# EAGLE design untitled (EAGLE 9.6.2)
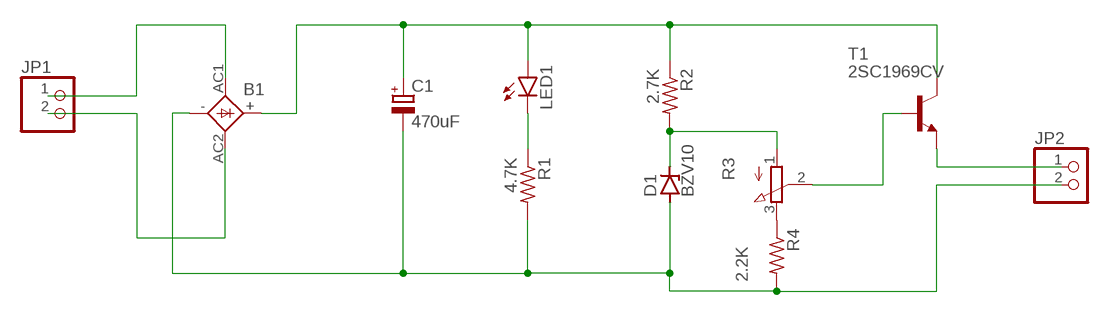
[diagram p0: schematic, sheet 1]

## Parts
B1  1KAB  [1KAB]
C1  470uF  CPOL-EUE3.5-10  [E3,5-10]
D1  BZV10  [DO34Z7]
JP1  PINHD-1X2  [1X02]
JP2  PINHD-1X2  [1X02]
LED1  LED5MM  [LED5MM]
R1  4.7K  R-US_0309/12  [0309/12]
R2  2.7K  R-US_0309/12  [0309/12]
R3  3RP/1610N  [3RP/1610N]
R4  2.2K  R-US_0309/12  [0309/12]
T1  2SC1969CV  [T-30_V]

## Nets
N$1: R3.3(E) R4.1
N$2: B1.AC1 JP1.1
N$3: B1.AC2 JP1.2
N$4: B1.+ C1.+ LED1.A R2.1 T1.2(C)
N$5: B1.- C1.- D1.A JP2.2 R1.2 R4.2
N$6: LED1.K(C) R1.1
N$7: D1.C R2.2 R3.1(A)
N$8: R3.2(S) T1.1(B)
N$9: JP2.1 T1.3(E)

## Library data of the parts
B1 = rectifier:1KAB: RECTIFIER grid 5,08 x 5,08 mm
C1 = rcl:CPOL-EU: POLARIZED CAPACITOR, European symbol; SPICEPREFIX: C
D1 = diode:BZV10: Z DIODE
JP1 JP2 = pinhead:PINHD-1X2: PIN HEADER
LED1 = led:LED: LED OSRAM: - CHIPLED LG R971, LG N971, LY N971, LG Q971, LY Q971, LO R971, LY R971 LH N974, LH R974 LS Q976, LO Q976, LY Q976 LO Q996 - Hyper CHIPLED LW Q18S LB Q993, LB Q99A, LB R99A - SideLED LS A670, LO A670, LY A670, LG A670, LP A670 LB A673, LV A673, LT A673, LW A673 LH A674 LY A675 LS A676, LA A676, LO A676, LY A676, LW A676 LS A679, LY A679, LG A679 - Hyper Micro SIDELED® LS Y876, LA Y876, LO Y876, LY Y876 LT Y87S - SmartLED LW L88C, LW L88S LB L89C, LB L89S, LG L890 LS L89K, LO L89K, LY L89K LS L896, LA L896, LO L896, LY L896 - TOPLED LS T670, LO T670, LY T670, LG T670, LP T670 LSG T670, LSP T670, LSY T670, LOP T670, LYG T670 LG T671, LOG T671, LSG T671 LB T673, LV T673, LT T673, LW T673 LH T674 LS T676, LA T676, LO T676, LY T676, LB T676, LH T676, LSB T676, LW T676 LB T67C, LV T67C, LT T67C, LS T67K, LO T67K, LY T67K, LW E67C LS E67B, LA E67B, LO E67B, LY E67B, LB E67C, LV E67C, LT E67C LW T67C LS T679, LY T679, LG T679 LS T770, LO T770, LY T770, LG T770, LP T770 LB T773, LV T773, LT T773, LW T773 LH T774 LS E675, LA E675, LY E675, LS T675 LS T776, LA T776, LO T776, LY T776, LB T776 LHGB T686 LT T68C, LB T68C - Hyper Mini TOPLED® LB M676 - Mini TOPLED Santana® LG M470 LS M47K, LO M47K, LY M47K Source: http://www.osram.convergy.de LUXEON: - LUMILED® LXK2-PW12-R00, LXK2-PW12-S00, LXK2-PW14-U00, LXK2-PW14-V00 LXK2-PM12-R00, LXK2-PM12-S00, LXK2-PM14-U00 LXK2-PE12-Q00, LXK2-PE12-R00, LXK2-PE12-S00, LXK2-PE14-T00, LXK2-PE14-U00 LXK2-PB12-K00, LXK2-PB12-L00, LXK2-PB12-M00, LXK2-PB14-N00, LXK2-PB14-P00, LXK2-PB14-Q00 LXK2-PR12-L00, LXK2-PR12-M00, LXK2-PR14-Q00, LXK2-PR14-R00 LXK2-PD12-Q00, LXK2-PD12-R00, LXK2-PD12-S00 LXK2-PH12-R00, LXK2-PH12-S00 LXK2-PL12-P00, LXK2-PL12-Q00, LXK2-PL12-R00 Source: www.luxeon.com KINGBRIGHT: KA-3528ASYC Source: www.kingbright.com
R1 R2 R4 = rcl:R-US_: RESISTOR, American symbol; SPICEPREFIX: R
R3 = pot:3RP/1610N: 16mm Potentiometer one level Source: http://www.alphapotentiometers.net/html/16mm_pot_2.html
T1 = transistor:2SC1969: NPN Epitaxial Planar Transistor RF Power Amplifier Source: 2sc1969.pdf

## Board
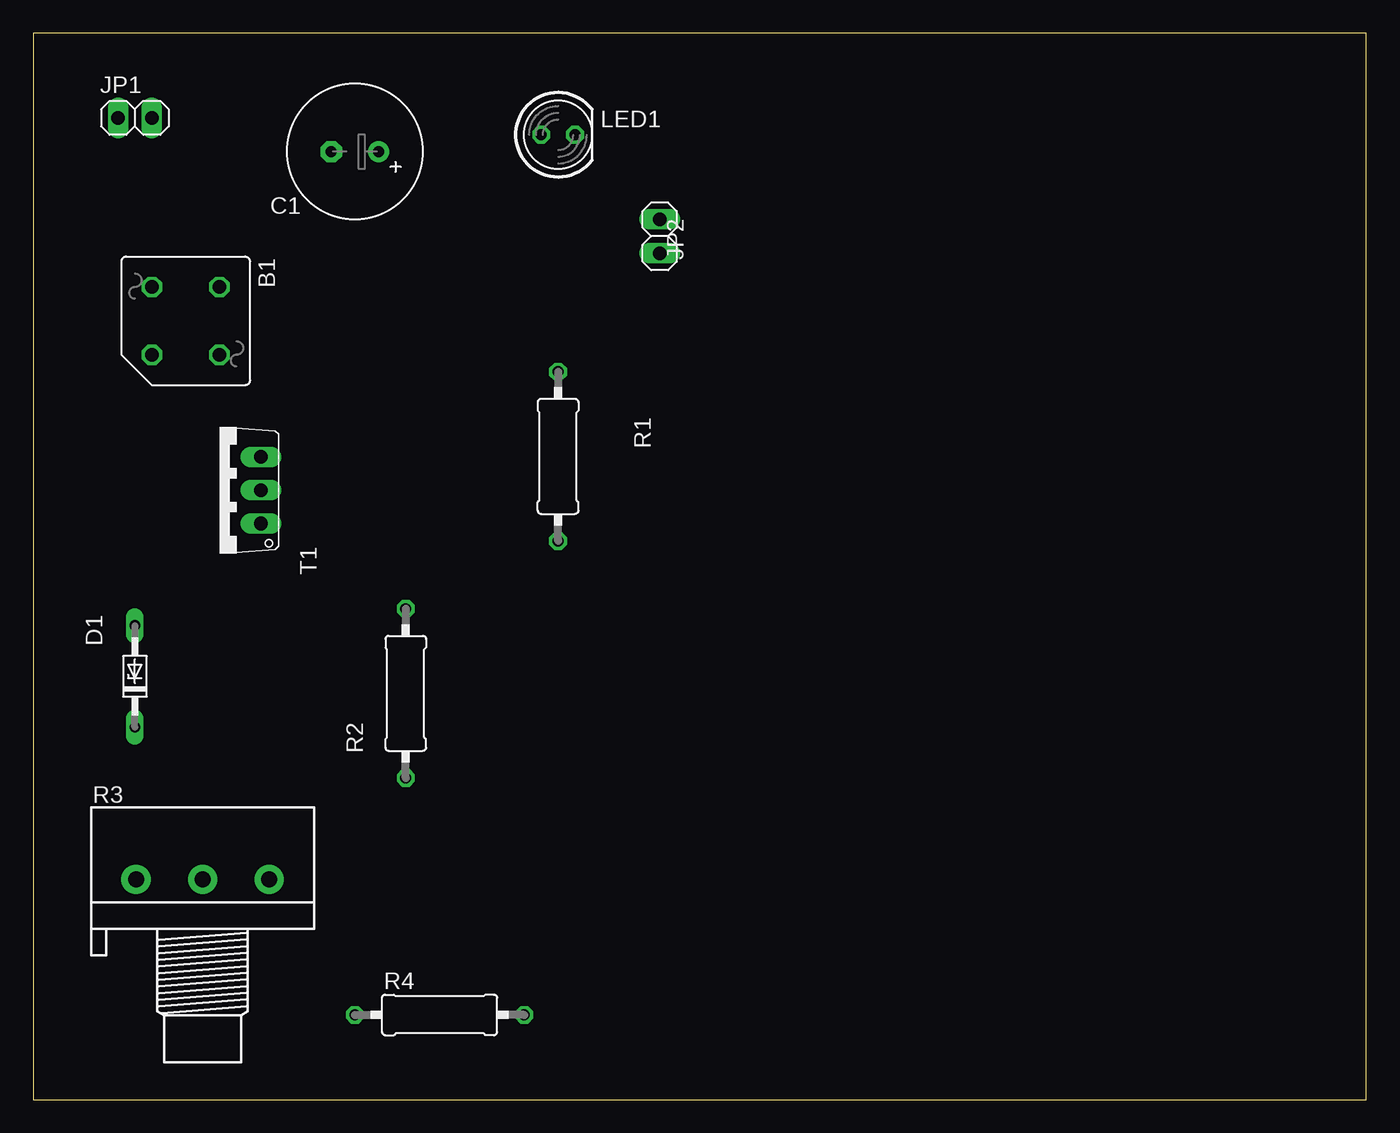
[diagram p1: board, top side]
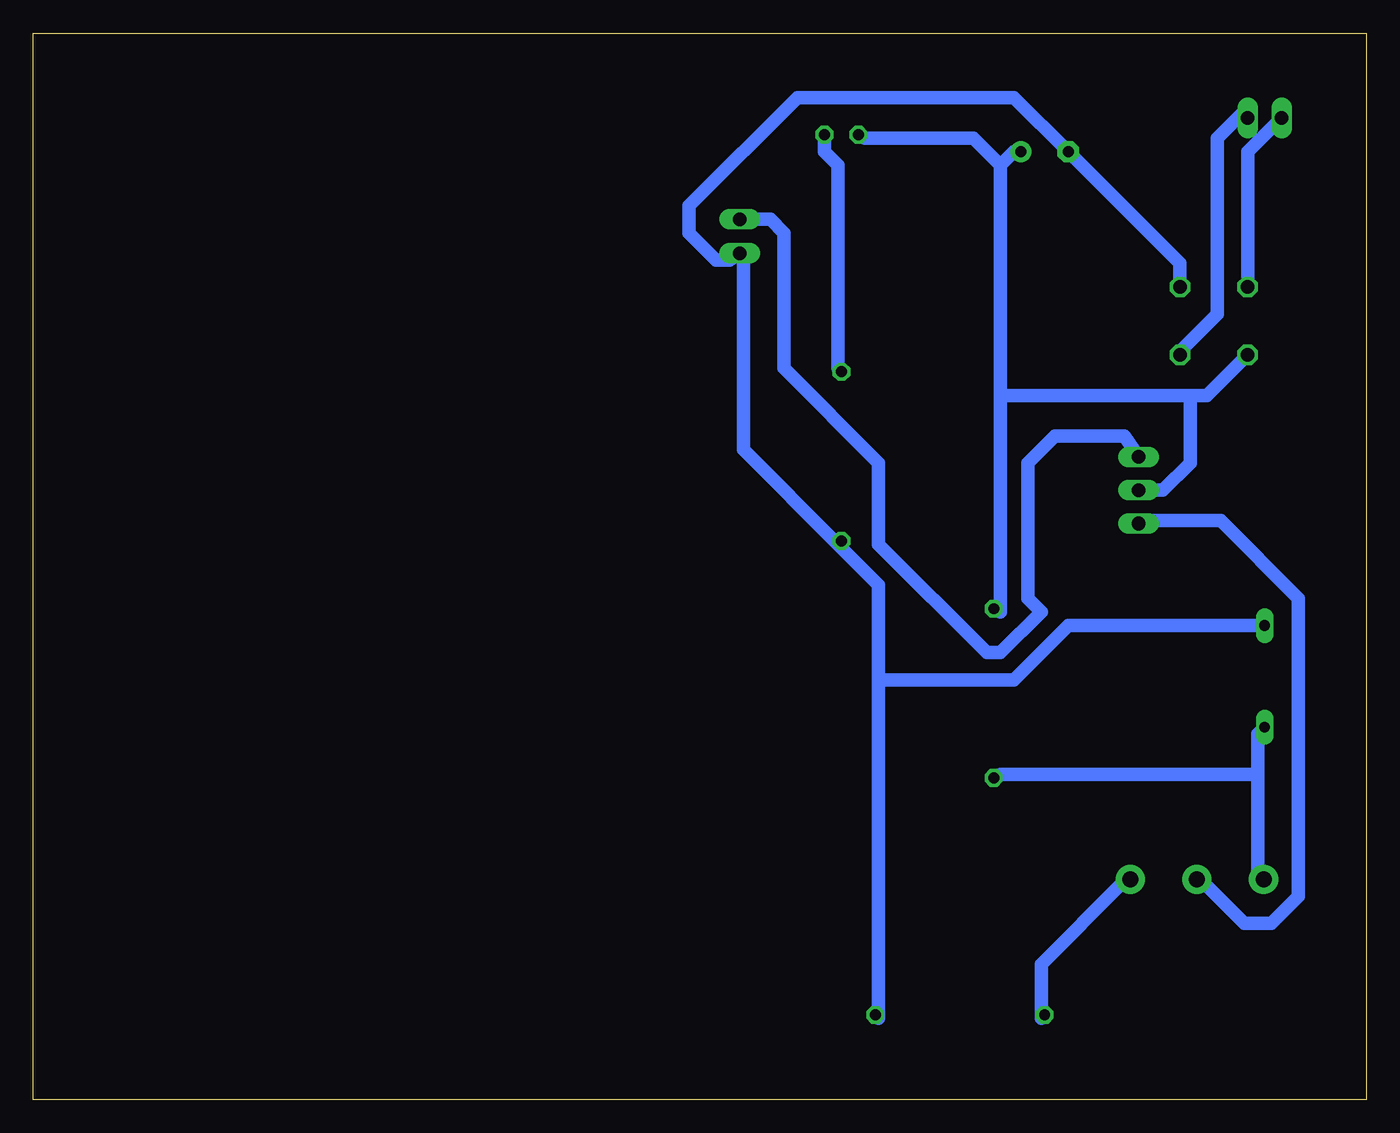
[diagram p2: board, bottom side, seen from below]

Size 100 x 80 mm. Coordinates in mm from the lower left corner, seen from the top.
Outline: 0,0 100,0 100,80 0,80 0,0
Copper layers (1*16): Top 0.035mm / dielectric 1.5mm / Bottom 0.035mm
Design rules "default *": minimum track width 40mil, minimum drill 0.35mm, track to track 40mil, track to pad 40mil, pad to pad 40mil, via to via 40mil, smd to smd 6mil, copper to edge 40mil, drill to drill 6mil, minimum pad ring 10mil, minimum via ring 8mil, stop-mask expansion 4mil, vias tented up to drill 0mil, thermal gap 10mil

### Footprints (pad centres in the part's own frame; a part is rotated, then mirrored left to right if it is on the bottom)
1KAB = drill 1.016 octagon: + 2.54,-2.54; - -2.54,2.54; AC1 -2.54,-2.54; AC2 2.54,2.54
E3,5-10 = drill 0.813 pad 1.6: + -1.778,0 | drill 0.813 pad 1.6 octagon: - 1.778,0
DO34Z7 = drill 0.813 long: A 3.81,0; C -3.81,0
1X02 = drill 1.016 long: 1 -1.27,0; 2 1.27,0
LED5MM = drill 0.813 octagon: A -1.27,0; K 1.27,0
0309/12 = drill 0.813 octagon: 1 -6.35,0; 2 6.35,0
3RP/1610N = drill 1.2 pad 2.184: 1 -5,0; 2 0,0; 3 5,0
T-30_V = drill 1.016 long: 1 -2.5,-3.1; 2 0,-3.1; 3 2.5,-3.1

### Placement (x,y rotation side)
B1  11.43,58.42 270 top
C1  24.13,71.12 180 top
D1  7.62,31.75 90 top
JP1  7.62,73.66 0 top
JP2  46.99,64.77 270 top
LED1  39.37,72.39 0 top
R1  39.37,48.26 270 top
R2  27.94,30.48 270 top
R3  12.7,16.51 0 top
R4  30.48,6.35 0 top
T1  13.97,45.72 90 top

### Tracks (layer width: path | path; a pad name or v marks a point on that pad's centre or on a via)
N$1
  Bottom 1.016: R4.1 24.38,6.1 24.38,10.16 18.29,16.26 R3.3
N$2
  Bottom 1.016: JP1.1 8.89,71.12 B1.AC1
N$3
  Bottom 1.016: JP1.2 9.14,74.17 11.18,72.14 11.18,58.93 14.22,55.88 B1.AC2
N$4
  Bottom 1.016: 27.43,70.1 27.43,52.83 | 27.43,52.83 27.43,36.58 R2.1 | 27.43,70.1 26.42,71.12 C1.+ | 27.43,70.1 29.46,72.14 37.59,72.14 LED1.A | B1.+ 11.94,52.83 13.21,52.83 | 27.43,52.83 13.21,52.83 | T1.2 15.24,45.72 13.21,47.75 13.21,52.83
N$5
  Bottom 1.016: B1.- 13.97,62.74 C1.- 26.42,75.18 42.67,75.18 50.8,67.06 50.8,65.02 48.77,62.99 47.75,62.99 JP2.2 46.74,62.99 46.74,48.77 39.62,41.66 | 36.58,31.5 36.58,38.61 39.62,41.66 | 36.58,31.5 36.58,6.1 R4.2 | D1.A 22.35,35.56 26.42,31.5 36.58,31.5 | 39.62,41.66 R1.2
N$6
  Bottom 1.016: LED1.K 40.64,71.12 39.62,70.1 39.62,54.86 R1.1
N$7
  Bottom 1.016: 8.13,24.38 8.13,17.27 R3.1 | 8.13,24.38 8.13,27.43 D1.C | 8.13,24.38 27.43,24.38 R2.2
N$8
  Bottom 1.016: T1.1 16.86,43.43 10.92,43.43 5.08,37.59 5.08,15.24 7.11,13.21 9.14,13.21 12.19,16.26 R3.2
N$9
  Bottom 1.016: JP2.1 44.7,66.04 43.69,65.02 43.69,54.86 36.58,47.75 36.58,41.66 28.45,33.53 27.43,33.53 24.38,36.58 25.4,37.59 25.4,47.75 23.37,49.78 18.14,49.78 T1.3